# EAGLE schematic environmental monitor (EAGLE 7.5.0)
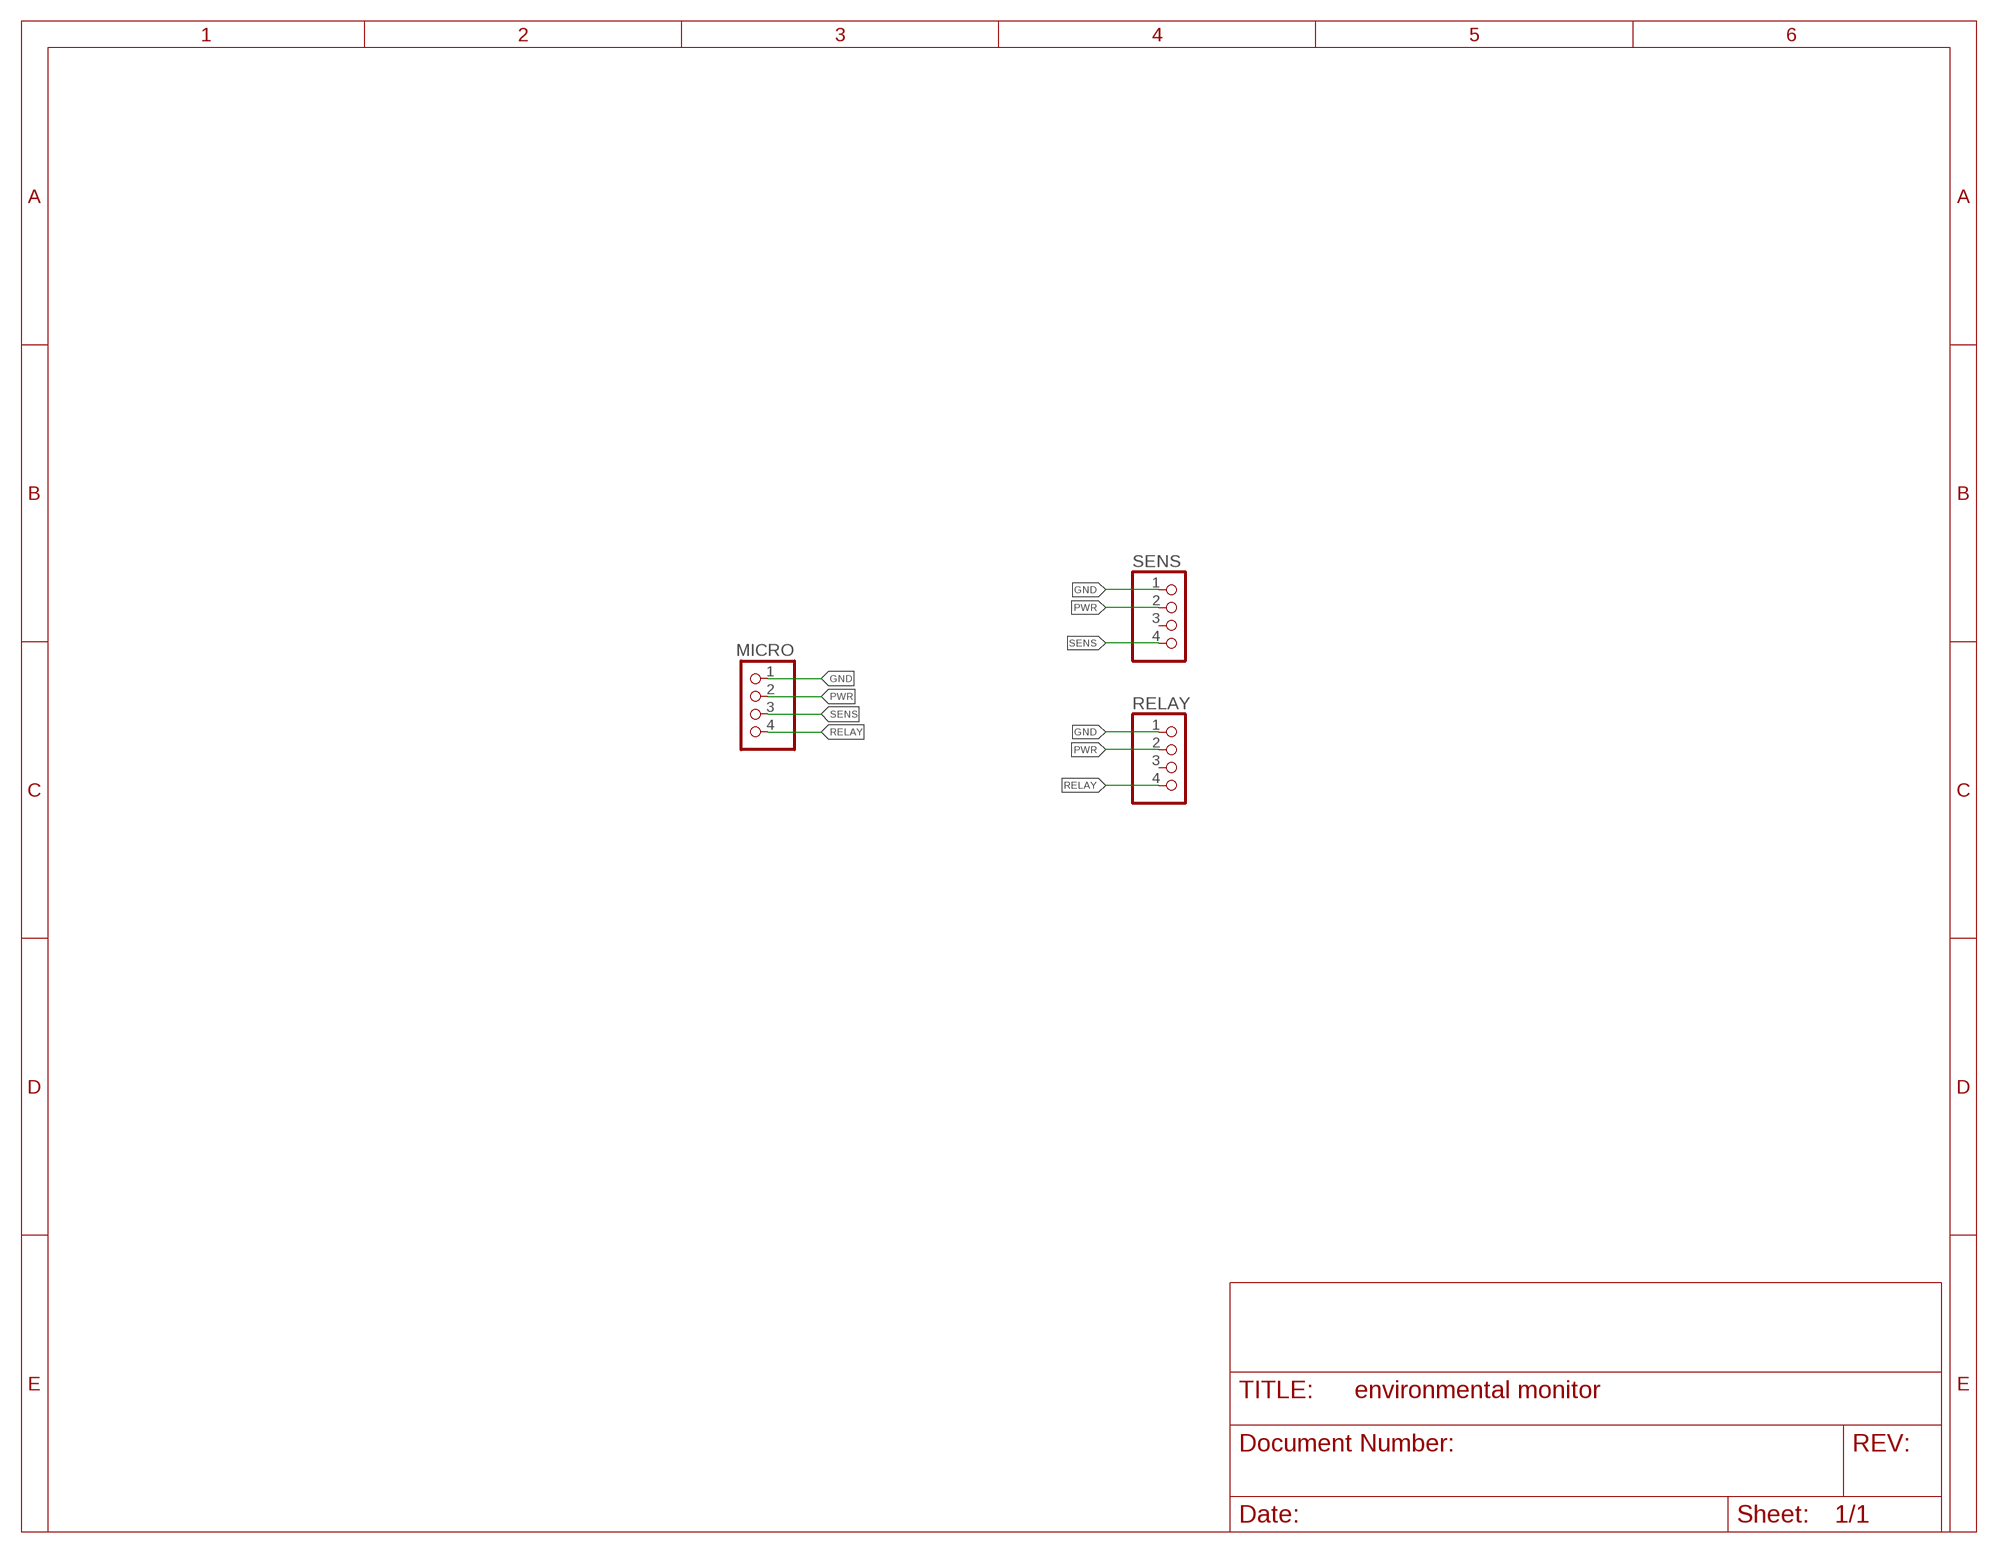
[diagram p0: schematic, sheet 1]

## Parts
MICRO  PINHD-1X4  [1X04]
RELAY  PINHD-1X4  [1X04]
SENS  PINHD-1X4  [1X04]

## Nets
GND: MICRO.1 RELAY.1 SENS.1
PWR: MICRO.2 RELAY.2 SENS.2
RELAY: MICRO.4 RELAY.4
SENS: MICRO.3 SENS.4
Unconnected: RELAY.3 SENS.3

## Library data of the parts
MICRO RELAY SENS = pinhead:PINHD-1X4: PIN HEADER